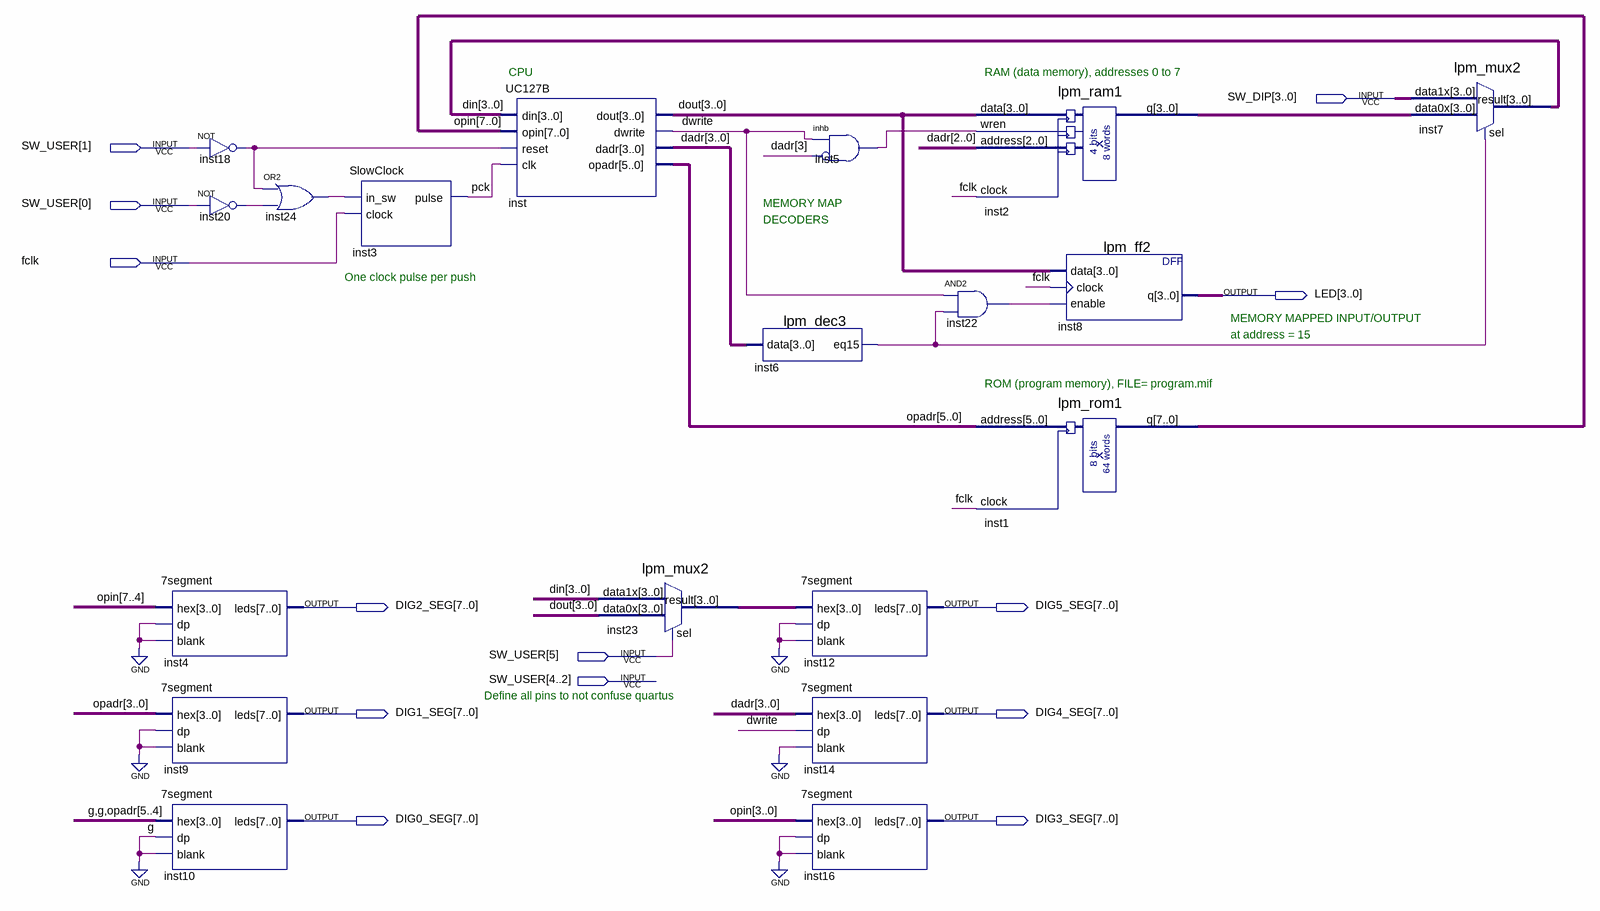
[diagram p0: schematic sheet]
// Quartus schematic LiveDesign.bdf as structural Verilog: 19 symbols, 13 pins
module LiveDesign (
  input  [3:0] SW_DIP,
  input  [5:0] SW_USER,
  input  fclk,
  output [3:0] LED,
  output [7:0] DIG2_SEG,
  output [7:0] DIG5_SEG,
  output [7:0] DIG1_SEG,
  output [7:0] DIG4_SEG,
  output [7:0] DIG0_SEG,
  output [7:0] DIG3_SEG
);

  wire dwrite, inst5_1, inst6_eq15, inst18_out, inst20_out, inst22_out, inst24_out, pck;
  wire [3:0] dadr, din, dout, inst2_q, inst23_result;
  wire [5:0] opadr;
  wire [7:0] opin;

  \7segment  inst4 (.hex(opin[7:4]), .dp(1'b0), .blank(1'b0), .leds(DIG2_SEG));
  \7segment  inst9 (.hex(opadr[3:0]), .dp(1'b0), .blank(1'b0), .leds(DIG1_SEG));
  \7segment  inst10 (.hex({2'b00, opadr[5:4]}), .dp(1'b0), .blank(1'b0), .leds(DIG0_SEG));
  not inst18 (inst18_out, SW_USER[1]);
  not inst20 (inst20_out, SW_USER[0]);
  or inst24 (inst24_out, inst18_out, inst20_out);
  SlowClock inst3 (.in_sw(inst24_out), .clock(fclk), .pulse(pck));
  UC127B inst (
    .din(din), .opin(opin), .reset(inst18_out), .clk(pck), .dout(dout), .dwrite(dwrite), .dadr(dadr),
    .opadr(opadr));
  lpm_mux2 inst23 (.data1x(din), .data0x(dout), .sel(SW_USER[5]), .result(inst23_result));
  lpm_dec3 inst6 (.data(dadr), .eq15(inst6_eq15));
  inhb inst5 (.\2 (dwrite), .\3 (dadr[3]), .\1 (inst5_1));
  \7segment  inst12 (.hex(inst23_result), .dp(1'b0), .blank(1'b0), .leds(DIG5_SEG));
  \7segment  inst14 (.hex(dadr), .dp(dwrite), .blank(1'b0), .leds(DIG4_SEG));
  \7segment  inst16 (.hex(opin[3:0]), .dp(1'b0), .blank(1'b0), .leds(DIG3_SEG));
  and inst22 (inst22_out, dwrite, inst6_eq15);
  lpm_ram1 inst2 (.data(dout), .wren(inst5_1), .address(dadr[2:0]), .clock(fclk), .q(inst2_q));
  lpm_rom1 inst1 (.address(opadr), .clock(fclk), .q(opin));
  lpm_ff2 inst8 (.data(dout), .clock(fclk), .enable(inst22_out), .q(LED));
  lpm_mux2 inst7 (.data1x(SW_DIP), .data0x(inst2_q), .sel(inst6_eq15), .result(din));

  // Notes on the sheet:
  //   CPU
  //   RAM (data memory), addresses 0 to 7
  //   MEMORY MAP
  //   DECODERS
  //   One clock pulse per push
  //   MEMORY MAPPED INPUT/OUTPUT
  //   at address = 15
  //   ROM (program memory), FILE= program.mif
  //   Define all pins to not confuse quartus
endmodule
